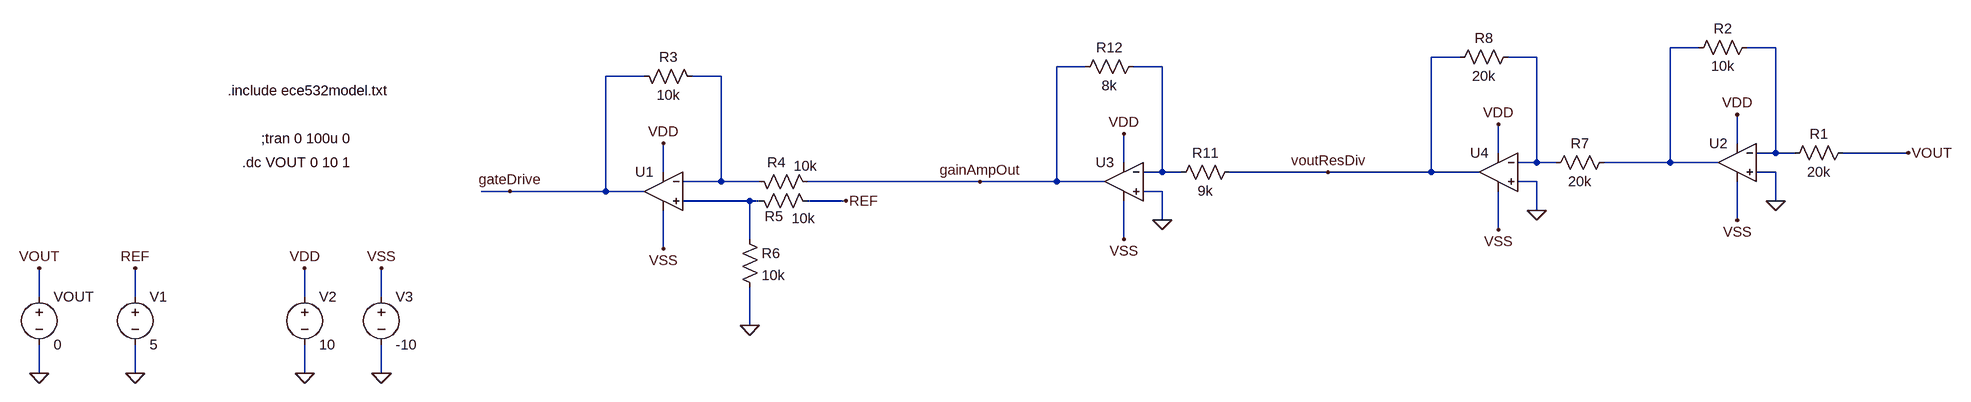
[diagram p0: schematic comparator_test.asc]
comparator_test.asc, the LTspice schematic file:
Version 4
SHEET 1 2252 680
WIRE 1728 -304 1680 -304
WIRE 1856 -304 1808 -304
WIRE 1280 -288 1232 -288
WIRE 1408 -288 1360 -288
WIRE 544 -272 496 -272
WIRE 672 -272 624 -272
WIRE -208 -256 -272 -256
WIRE -80 -256 -128 -256
WIRE 1792 -144 1792 -192
WIRE 1344 -128 1344 -176
WIRE 1856 -128 1856 -304
WIRE 1856 -128 1824 -128
WIRE 1888 -128 1856 -128
WIRE 2112 -128 1968 -128
WIRE 608 -112 608 -160
WIRE 1408 -112 1408 -288
WIRE 1408 -112 1376 -112
WIRE 1440 -112 1408 -112
WIRE 1680 -112 1680 -304
WIRE 1680 -112 1520 -112
WIRE 1760 -112 1680 -112
WIRE -176 -96 -176 -144
WIRE 672 -96 672 -272
WIRE 672 -96 640 -96
WIRE 704 -96 672 -96
WIRE 960 -96 784 -96
WIRE 1232 -96 1232 -288
WIRE 1232 -96 960 -96
WIRE 1312 -96 1232 -96
WIRE 1856 -96 1824 -96
WIRE -80 -80 -80 -256
WIRE -80 -80 -144 -80
WIRE -16 -80 -80 -80
WIRE 368 -80 64 -80
WIRE 496 -80 496 -272
WIRE 496 -80 368 -80
WIRE 576 -80 496 -80
WIRE 1408 -80 1376 -80
WIRE -432 -64 -480 -64
WIRE -272 -64 -272 -256
WIRE -272 -64 -432 -64
WIRE -208 -64 -272 -64
WIRE 672 -64 640 -64
WIRE -32 -48 -144 -48
WIRE -16 -48 -32 -48
WIRE 128 -48 64 -48
WIRE 1856 -48 1856 -96
WIRE 1408 -32 1408 -80
WIRE 672 -16 672 -64
WIRE 1792 -16 1792 -80
WIRE 1344 0 1344 -64
WIRE -32 16 -32 -48
WIRE 608 16 608 -48
WIRE -176 32 -176 -32
WIRE -1408 112 -1408 64
WIRE -1248 112 -1248 64
WIRE -944 112 -944 64
WIRE -816 112 -816 64
WIRE -32 160 -32 96
WIRE -1408 240 -1408 192
WIRE -1248 240 -1248 192
WIRE -944 240 -944 192
WIRE -816 240 -816 192
FLAG -32 160 0
FLAG -176 -144 VDD
FLAG -944 240 0
FLAG -944 64 VDD
FLAG -816 240 0
FLAG -816 64 VSS
FLAG -176 32 VSS
FLAG -1408 240 0
FLAG -1408 64 VOUT
FLAG 608 -160 VDD
FLAG 608 16 VSS
FLAG 672 -16 0
FLAG 960 -96 voutResDiv
FLAG 368 -80 gainAmpOut
FLAG 128 -48 REF
FLAG -1248 240 0
FLAG -1248 64 REF
FLAG -432 -64 gateDrive
FLAG 1792 -192 VDD
FLAG 1792 -16 VSS
FLAG 1856 -48 0
FLAG 2112 -128 VOUT
FLAG 1344 -176 VDD
FLAG 1344 0 VSS
FLAG 1408 -32 0
SYMBOL res -224 -272 M90
WINDOW 0 0 56 VBottom 2
WINDOW 3 32 56 VTop 2
SYMATTR InstName R3
SYMATTR Value 10k
SYMBOL res -32 -96 M90
WINDOW 0 0 44 VBottom 2
WINDOW 3 -26 93 VTop 2
SYMATTR InstName R4
SYMATTR Value 10k
SYMBOL res -32 -64 M90
WINDOW 0 58 40 VBottom 2
WINDOW 3 30 89 VTop 2
SYMATTR InstName R5
SYMATTR Value 10k
SYMBOL res -48 0 R0
SYMATTR InstName R6
SYMATTR Value 10k
SYMBOL Opamps\\UniversalOpamp2 -176 -64 M0
SYMATTR InstName U1
SYMBOL voltage -944 96 R0
WINDOW 123 0 0 Left 2
WINDOW 39 0 0 Left 2
SYMATTR InstName V2
SYMATTR Value 10
SYMBOL voltage -816 96 R0
WINDOW 123 0 0 Left 2
WINDOW 39 0 0 Left 2
SYMATTR InstName V3
SYMATTR Value -10
SYMBOL voltage -1408 96 R0
WINDOW 123 0 0 Left 2
WINDOW 39 0 0 Left 2
SYMATTR InstName VOUT
SYMATTR Value 0
SYMBOL Opamps\\UniversalOpamp2 608 -80 M0
SYMATTR InstName U3
SYMBOL res 688 -80 R270
WINDOW 0 32 56 VTop 2
WINDOW 3 0 56 VBottom 2
SYMATTR InstName R11
SYMATTR Value 9k
SYMBOL res 528 -256 R270
WINDOW 0 32 56 VTop 2
WINDOW 3 0 56 VBottom 2
SYMATTR InstName R12
SYMATTR Value 8k
SYMBOL voltage -1248 96 R0
WINDOW 123 0 0 Left 2
WINDOW 39 0 0 Left 2
SYMATTR InstName V1
SYMATTR Value 5
SYMBOL Opamps\\UniversalOpamp2 1792 -112 M0
SYMATTR InstName U2
SYMBOL res 1872 -112 R270
WINDOW 0 32 56 VTop 2
WINDOW 3 0 56 VBottom 2
SYMATTR InstName R1
SYMATTR Value 20k
SYMBOL res 1712 -288 R270
WINDOW 0 32 56 VTop 2
WINDOW 3 0 56 VBottom 2
SYMATTR InstName R2
SYMATTR Value 10k
SYMBOL Opamps\\UniversalOpamp2 1344 -96 M0
SYMATTR InstName U4
SYMBOL res 1424 -96 R270
WINDOW 0 32 56 VTop 2
WINDOW 3 0 56 VBottom 2
SYMATTR InstName R7
SYMATTR Value 20k
SYMBOL res 1264 -272 R270
WINDOW 0 32 56 VTop 2
WINDOW 3 0 56 VBottom 2
SYMATTR InstName R8
SYMATTR Value 20k
TEXT -1016 -152 Left 2 !;tran 0 100u 0
TEXT -1072 -232 Left 2 !.include ece532model.txt
TEXT -1048 -112 Left 2 !.dc VOUT 0 10 1

The netlist it stands for:
* comparator_test.asc
R3 gateDrive N005 10k
R4 N005 gainAmpOut 10k
R5 N006 REF 10k
R6 N006 0 10k
XU1 N006 N005 VDD VSS gateDrive level.2 Avol=1Meg GBW=10Meg Slew=10Meg ilimit=25m rail=0 Vos=0 phimargin=45 en=0 enk=0 in=0 ink=0 Rin=500Meg  ; pins IN+ IN- V+ V- OUT
V2 VDD 0 10
V3 VSS 0 -10
VOUT VOUT 0 0
XU3 0 N004 VDD VSS gainAmpOut level.2 Avol=1Meg GBW=10Meg Slew=10Meg ilimit=25m rail=0 Vos=0 phimargin=45 en=0 enk=0 in=0 ink=0 Rin=500Meg  ; pins IN+ IN- V+ V- OUT
R11 N004 voutResDiv 9k
R12 gainAmpOut N004 8k
V1 REF 0 5
XU2 0 N002 VDD VSS N001 level.2 Avol=1Meg GBW=10Meg Slew=10Meg ilimit=25m rail=0 Vos=0 phimargin=45 en=0 enk=0 in=0 ink=0 Rin=500Meg  ; pins IN+ IN- V+ V- OUT
R1 N002 VOUT 20k
R2 N001 N002 10k
XU4 0 N003 VDD VSS voutResDiv level.2 Avol=1Meg GBW=10Meg Slew=10Meg ilimit=25m rail=0 Vos=0 phimargin=45 en=0 enk=0 in=0 ink=0 Rin=500Meg  ; pins IN+ IN- V+ V- OUT
R7 N003 N001 20k
R8 voutResDiv N003 20k
;tran 0 100u 0
.include ece532model.txt
.dc VOUT 0 10 1
.lib UniversalOpamps2.sub
.backanno
.end